# Altium schematic sheet MCU.SchDoc
size A4
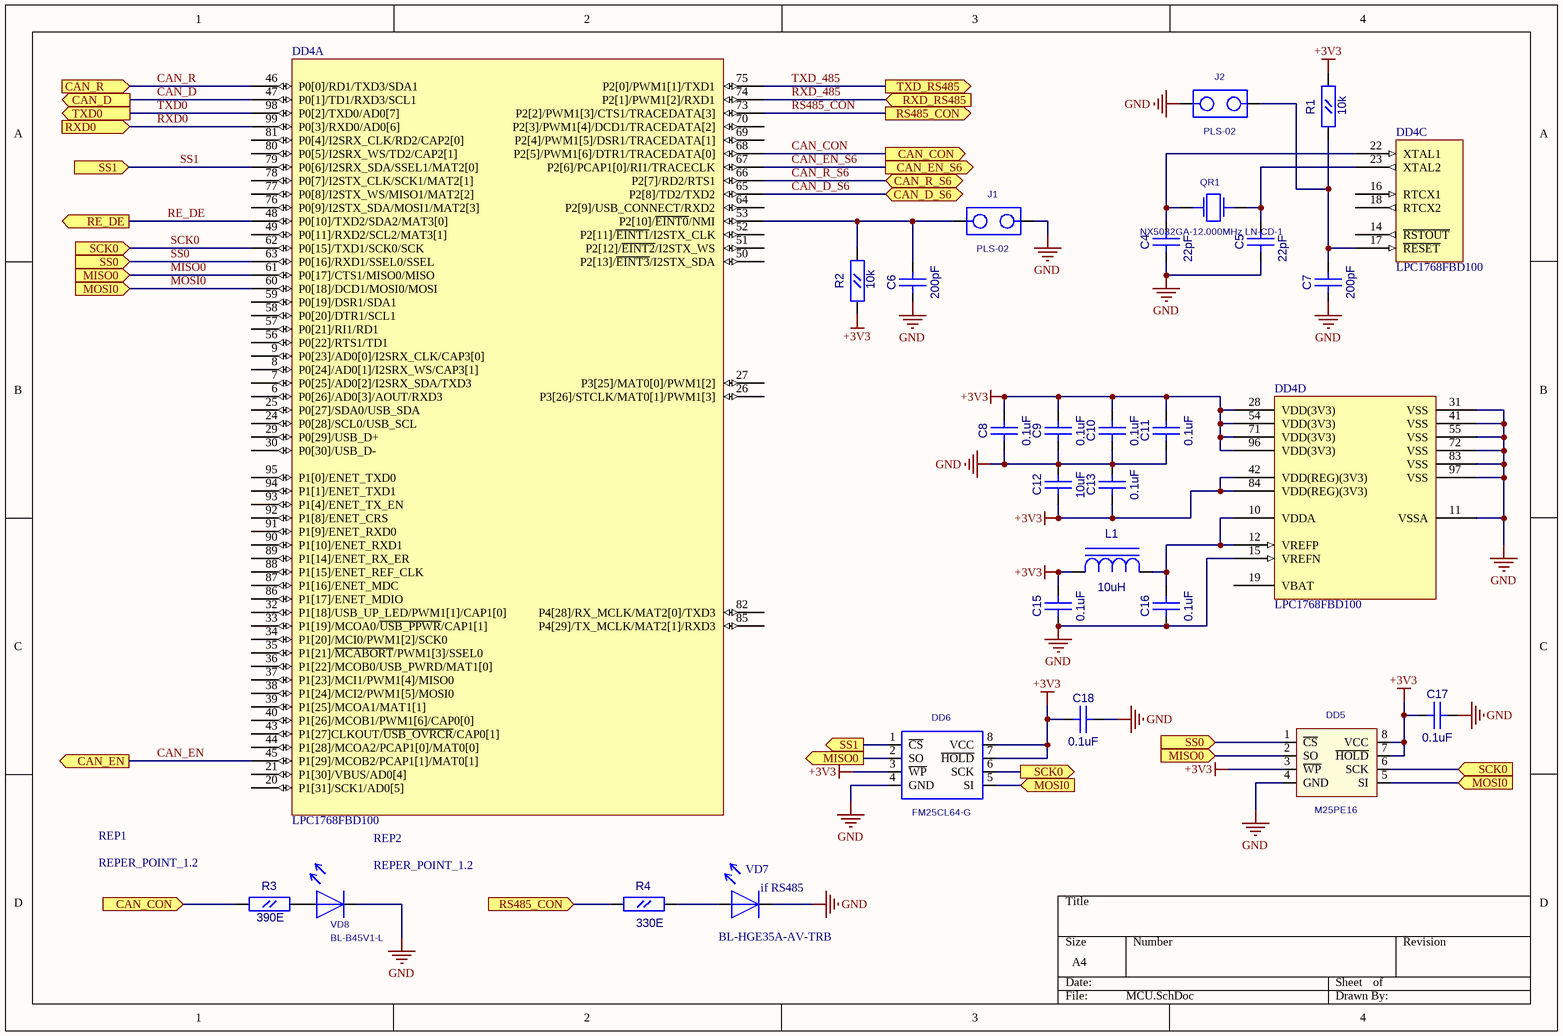
[diagram p0: MCU.SchDoc]

## Parts
C4  22pF  [CC0603]
C5  22pF  [CC0603]
C6  200pF  [CC0603]
C7  200pF  [CC0603]
C8  0.1uF  [CC0603]
C9  0.1uF  [CC0603]
C10  0.1uF  [CC0603]
C11  0.1uF  [CC0603]
C12  10uF  [CC0805]
C13  0.1uF  [CC0603]
C15  0.1uF  [CC0603]
C16  0.1uF  [CC0603]
C17  0.1uF  [CC0603]
C18  0.1uF  [CC0603-3M]
DD4  LPC1768FBD100  [TQFP-100]  (parts A,C,D of 4)
DD5  M25PE16  [EIAJ_SO8]
DD6  FM25CL64-G  [SO-8]
J1  PLS-02  [PLS-02]
J2  PLS-02  [PLS-02]
L1  10uH  [L0603]
QR1  NX5032GA-12.000MHz LN-CD-1  [AC5032_2]
R1  10k  [RC0603]
R2  10k  [RC0603]
R3  390E  [RC0603]
R4  330E  [RC0603]
REP1  REPER_POINT_1.2  [REPER1.2]
REP2  REPER_POINT_1.2  [REPER1.2]
VD7  BL-HGE35A-AV-TRB  [LED0805]
VD8  BL-B45V1-L  [LED3]

## Ports
CAN_CON (in), CAN_CON (out), CAN_D (out), CAN_D_S6, CAN_EN (out), CAN_EN_S6 (out), CAN_R (in), CAN_R_S6, MISO0 (in), MISO0 (out), MOSI0 (in), RE_DE (out), RS485_CON (in), RS485_CON (out), RXD0 (in), RXD_RS485 (in), SCK0 (in), SCK0 (out), SS0 (in), SS1 (in), SS1 (out), TXD0 (out), TXD_RS485 (out)

## Nets
+3V3: C8.2(B) C9.2(B) C10.2(B) C11.2(B) C12.1(A) C13.1(A) C15.2(B) C17.1(A) C18.1(A) DD4.28(VDD(3V3)) DD4.42(VDD(REG)(3V3)) DD4.54(VDD(3V3)) DD4.71(VDD(3V3)) DD4.84(VDD(REG)(3V3)) DD4.96(VDD(3V3)) DD5.3(~{WP}) DD5.7(~{HOLD}) DD5.8(VCC) DD6.3(~{WP}) DD6.7(~{HOLD}) DD6.8(VCC) L1.1(A) R1.2(B) R2.1(A)
GND: C4.1(A) C5.1(A) C6.1(A) C7.1(A) C8.1(A) C9.1(A) C10.1(A) C11.1(A) C12.2(B) C13.2(B) C15.1(A) C16.1(A) C17.2(B) C18.2(B) DD4.11(VSSA) DD4.15(VREFN) DD4.31(VSS) DD4.41(VSS) DD4.55(VSS) DD4.72(VSS) DD4.83(VSS) DD4.97(VSS) DD5.4(GND) DD6.4(GND) J1.2 J2.1 VD7.2 VD8.1
CAN_CON: DD4.68(P2[5]/PWM1[6]/DTR1/TRACEDATA[0]) R3.1(A) ; port CAN_CON
CAN_D: DD4.47(P0[1]/TD1/RXD3/SCL1) ; port CAN_D
CAN_D_S6: DD4.65(P2[8]/TD2/TXD2) ; port CAN_D_S6
CAN_EN: DD4.45(P1[29]/MCOB2/PCAP1[1]/MAT0[1]) ; port CAN_EN
CAN_EN_S6: DD4.67(P2[6]/PCAP1[0]/RI1/TRACECLK) ; port CAN_EN_S6
CAN_R: DD4.46(P0[0]/RD1/TXD3/SDA1) ; port CAN_R
CAN_R_S6: DD4.66(P2[7]/RD2/RTS1) ; port CAN_R_S6
MISO0: DD4.61(P0[17]/CTS1/MISO0/MISO) DD5.2(SO) DD6.2(SO) ; port MISO0
MOSI0: DD4.60(P0[18]/DCD1/MOSI0/MOSI) DD5.5(SI) DD6.5(SI) ; port MOSI0
RE_DE: DD4.48(P0[10]/TXD2/SDA2/MAT3[0]) ; port RE_DE
RS485_CON: DD4.73(P2[2]/PWM1[3]/CTS1/TRACEDATA[3]) R4.1(A) ; port RS485_CON
RXD0: DD4.99(P0[3]/RXD0/AD0[6]) ; port RXD0
RXD_485: DD4.74(P2[1]/PWM1[2]/RXD1) ; port RXD_RS485
SCK0: DD4.62(P0[15]/TXD1/SCK0/SCK) DD5.6(SCK) DD6.6(SCK) ; port SCK0
SS0: DD4.63(P0[16]/RXD1/SSEL0/SSEL) DD5.1(~{CS}) ; port SS0
SS1: DD4.79(P0[6]/I2SRX_SDA/SSEL1/MAT2[0]) DD6.1(~{CS}) ; port SS1
TXD0: DD4.98(P0[2]/TXD0/AD0[7]) ; port TXD0
TXD_485: DD4.75(P2[0]/PWM1[1]/TXD1) ; port TXD_RS485
NetC4_2: C4.2(B) DD4.22(XTAL1) QR1.1
NetC5_2: C5.2(B) DD4.23(XTAL2) QR1.2
NetC6_2: C6.2(B) DD4.53(P2[10]/~{EINT0}/NMI) J1.1 R2.2(B)
NetC7_2: C7.2(B) DD4.17(~{RESET}) J2.2 R1.1(A)
NetC16_2: C16.2(B) DD4.10(VDDA) DD4.12(VREFP) L1.2(C)
NetR3_2: R3.2(B) VD8.2
NetR4_2: R4.2(B) VD7.1

Not connected (* = marked no-connect by the designer): DD4 6(P0[26]/AD0[3]/AOUT/RXD3) 7(P0[25]/AD0[2]/I2SRX_SDA/TXD3) 8(P0[24]/AD0[1]/I2SRX_WS/CAP3[1]) 9(P0[23]/AD0[0]/I2SRX_CLK/CAP3[0]) 14(~{RSTOUT}) 16(RTCX1) 18(RTCX2) 19(VBAT) 20(P1[31]/SCK1/AD0[5]) 21(P1[30]/VBUS/AD0[4]) 24(P0[28]/SCL0/USB_SCL) 25(P0[27]/SDA0/USB_SDA) 26(P3[26]/STCLK/MAT0[1]/PWM1[3]) 27(P3[25]/MAT0[0]/PWM1[2]) 29(P0[29]/USB_D+) 30(P0[30]/USB_D-) 32(P1[18]/USB_UP_LED/PWM1[1]/CAP1[0]) 33(P1[19]/MCOA0/~{USB_PPWR}/CAP1[1]) 34(P1[20]/MCI0/PWM1[2]/SCK0) 35(P1[21]/~{MCABORT}/PWM1[3]/SSEL0) 36(P1[22]/MCOB0/USB_PWRD/MAT1[0]) 37(P1[23]/MCI1/PWM1[4]/MISO0) 38(P1[24]/MCI2/PWM1[5]/MOSI0) 39(P1[25]/MCOA1/MAT1[1]) 40(P1[26]/MCOB1/PWM1[6]/CAP0[0]) 43(P1[27]CLKOUT/~{USB_OVRCR}/CAP0[1]) 44(P1[28]/MCOA2/PCAP1[0]/MAT0[0]) 49(P0[11]/RXD2/SCL2/MAT3[1]) 50(P2[13]/~{EINT3}/I2STX_SDA) 51(P2[12]/~{EINT2}/I2STX_WS) 52(P2[11]/~{EINT1}/I2STX_CLK) 56(P0[22]/RTS1/TD1) 57(P0[21]/RI1/RD1) 58(P0[20]/DTR1/SCL1) 59(P0[19]/DSR1/SDA1) 64(P2[9]/USB_CONNECT/RXD2) 69(P2[4]/PWM1[5]/DSR1/TRACEDATA[1]) 70(P2[3]/PWM1[4]/DCD1/TRACEDATA[2]) 76(P0[9]/I2STX_SDA/MOSI1/MAT2[3]) 77(P0[8]/I2STX_WS/MISO1/MAT2[2]) 78(P0[7]/I2STX_CLK/SCK1/MAT2[1]) 80(P0[5]/I2SRX_WS/TD2/CAP2[1]) 81(P0[4]/I2SRX_CLK/RD2/CAP2[0]) 82(P4[28]/RX_MCLK/MAT2[0]/TXD3) 85(P4[29]/TX_MCLK/MAT2[1]/RXD3) 86(P1[17]/ENET_MDIO) 87(P1[16]/ENET_MDC) 88(P1[15]/ENET_REF_CLK) 89(P1[14]/ENET_RX_ER) 90(P1[10]/ENET_RXD1) 91(P1[9]/ENET_RXD0) 92(P1[8]/ENET_CRS) 93(P1[4]/ENET_TX_EN) 94(P1[1]/ENET_TXD1) 95(P1[0]/ENET_TXD0); REP1 1; REP2 1

## Notes on the sheet
- (near VD7) if RS485

## Library data of the parts
C4-C11 C13 C15-C18 = CC0603
  C4 C5: Value: 22pF
  C6 C7: Value: 200pF
  C8-C11 C13 C15-C18: Value: 0.1uF
C12 = CC0805: Value: 10uF
DD4 = LPC1768FBD100: Cortex -M3 32-Bit Microcontroller, 512KB Flash, 64KB RAM, 100-Lead LQFP; ComponentLink1Description: Manufacturer Link; ComponentLink1URL: http://www.nxp.com/
DD5 = S25FL016A0LMFI01: Value: M25PE16
L1 = L0603: Value: 10uH
QR1 = AC5032_2: AC5032/2; Value: NX5032GA-12.000MHz LN-CD-1
R1-R4 = RC0603
  R1 R2: Value: 10k
  R3: Value: 390E
  R4: Value: 330E
REP1 REP2 = REPER1.2: Value: REPER_POINT_1.2
VD7 = LED_0805: Value: BL-HGE35A-AV-TRB
VD8 = LED_3: Value: BL-B45V1-L
DD6 = FM25CL64-G: Value: *
J1 J2 = PLS-02: Value: *